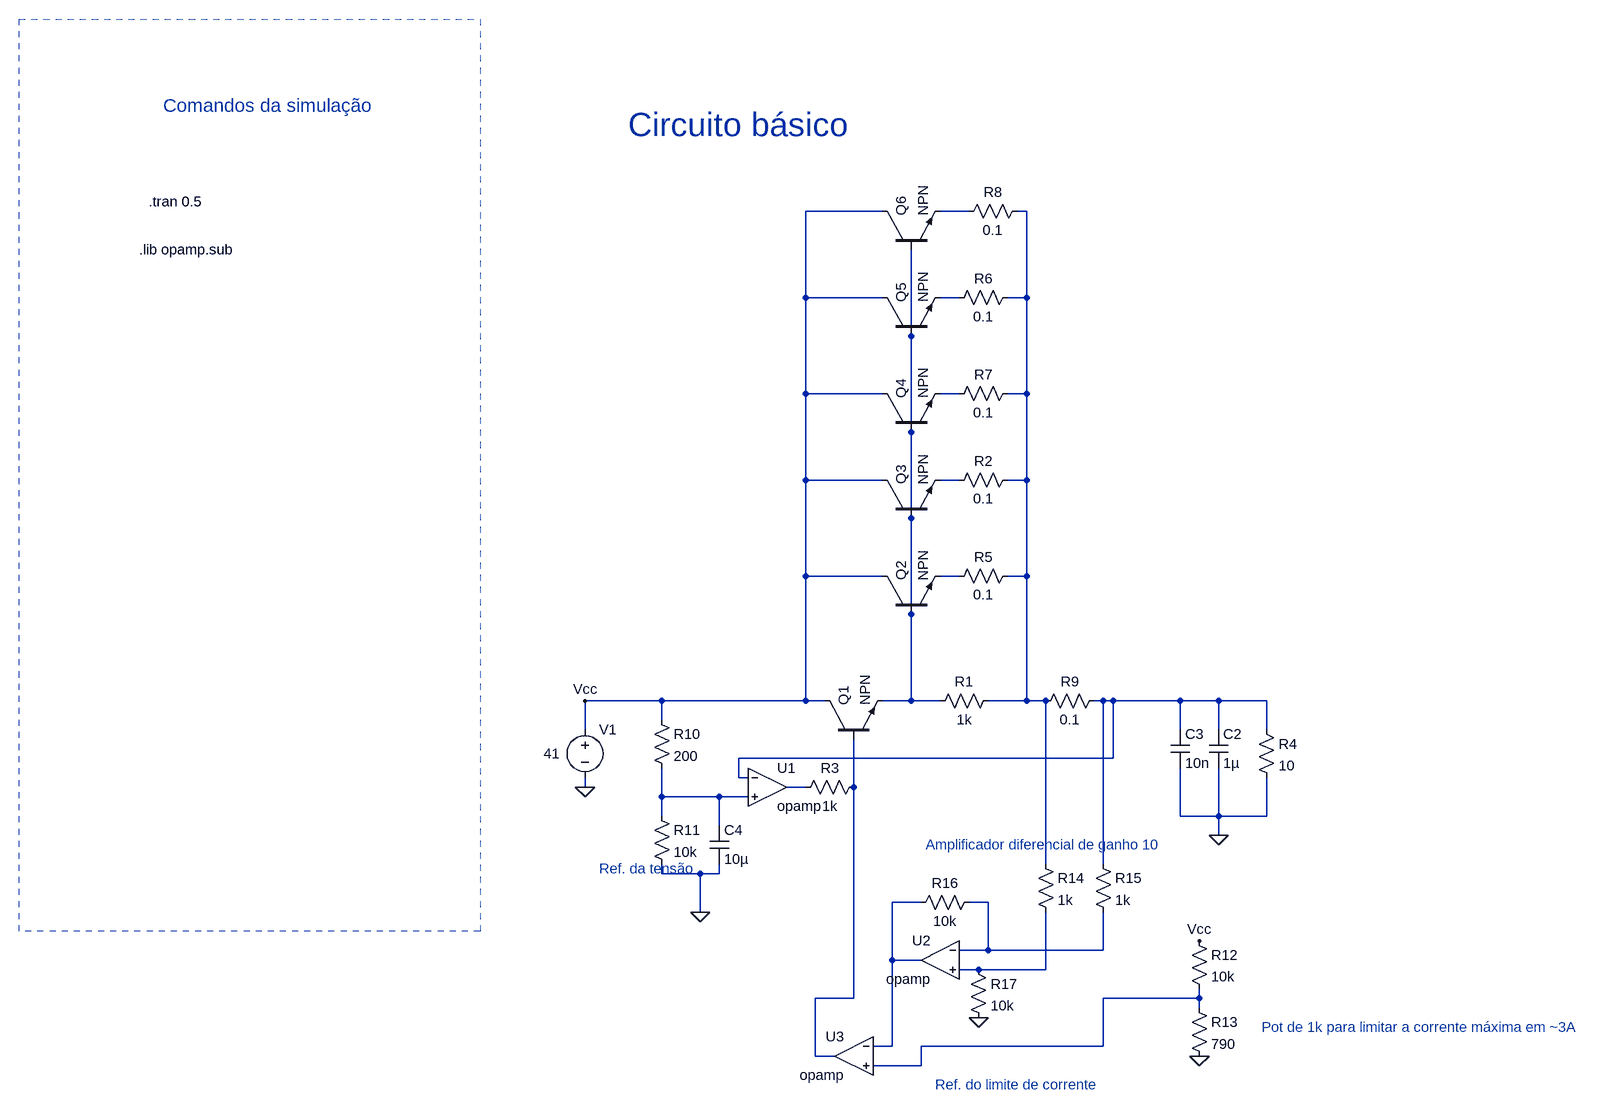
[diagram p0: schematic SimV2.asc]
SimV2.asc, the LTspice schematic file:
Version 4
SHEET 1 4884 2916
WIRE -64 240 -192 240
WIRE 80 240 32 240
WIRE 176 240 160 240
WIRE -192 384 -192 240
WIRE -64 384 -192 384
WIRE 64 384 32 384
WIRE 176 384 176 240
WIRE 176 384 144 384
WIRE -16 448 -16 304
WIRE -192 544 -192 384
WIRE -64 544 -192 544
WIRE 64 544 32 544
WIRE 176 544 176 384
WIRE 176 544 144 544
WIRE -16 608 -16 448
WIRE -192 688 -192 544
WIRE -64 688 -192 688
WIRE 64 688 32 688
WIRE 176 688 176 544
WIRE 176 688 144 688
WIRE -16 752 -16 608
WIRE -192 848 -192 688
WIRE -64 848 -192 848
WIRE 64 848 32 848
WIRE 176 848 176 688
WIRE 176 848 144 848
WIRE -16 912 -16 752
WIRE -432 1056 -560 1056
WIRE -192 1056 -192 848
WIRE -192 1056 -432 1056
WIRE -160 1056 -192 1056
WIRE -16 1056 -16 912
WIRE -16 1056 -64 1056
WIRE 32 1056 -16 1056
WIRE 176 1056 176 848
WIRE 176 1056 112 1056
WIRE 208 1056 176 1056
WIRE 304 1056 288 1056
WIRE 320 1056 304 1056
WIRE 432 1056 320 1056
WIRE 496 1056 432 1056
WIRE 576 1056 496 1056
WIRE -432 1088 -432 1056
WIRE -560 1104 -560 1056
WIRE 432 1104 432 1056
WIRE 496 1104 496 1056
WIRE 576 1104 576 1056
WIRE 320 1152 320 1056
WIRE 320 1152 -304 1152
WIRE -304 1184 -304 1152
WIRE -288 1184 -304 1184
WIRE -560 1200 -560 1184
WIRE -192 1200 -224 1200
WIRE -112 1200 -112 1120
WIRE -432 1216 -432 1168
WIRE -336 1216 -432 1216
WIRE -288 1216 -336 1216
WIRE -432 1248 -432 1216
WIRE 432 1248 432 1168
WIRE 496 1248 496 1168
WIRE 496 1248 432 1248
WIRE 576 1248 576 1184
WIRE 576 1248 496 1248
WIRE -336 1264 -336 1216
WIRE 496 1280 496 1248
WIRE 208 1328 208 1056
WIRE 304 1328 304 1056
WIRE -432 1344 -432 1328
WIRE -368 1344 -432 1344
WIRE -336 1344 -336 1328
WIRE -336 1344 -368 1344
WIRE 0 1392 -48 1392
WIRE 112 1392 80 1392
WIRE -368 1408 -368 1344
WIRE 112 1472 112 1392
WIRE 112 1472 64 1472
WIRE 304 1472 304 1408
WIRE 304 1472 112 1472
WIRE -48 1488 -48 1392
WIRE 0 1488 -48 1488
WIRE 96 1504 64 1504
WIRE 208 1504 208 1408
WIRE 208 1504 96 1504
WIRE -112 1552 -112 1200
WIRE -112 1552 -176 1552
WIRE 464 1552 464 1536
WIRE 464 1552 304 1552
WIRE 464 1568 464 1552
WIRE -48 1632 -48 1488
WIRE -48 1632 -80 1632
WIRE 304 1632 304 1552
WIRE 304 1632 0 1632
WIRE -176 1648 -176 1552
WIRE -144 1648 -176 1648
WIRE 0 1664 0 1632
WIRE 0 1664 -80 1664
FLAG -368 1408 0
FLAG -560 1200 0
FLAG -560 1056 Vcc
FLAG 496 1280 0
FLAG 464 1456 Vcc
FLAG 464 1648 0
FLAG 96 1584 0
DATAFLAG 400 992 "V(n002)-V(n008)"
SYMBOL OpAmps\\opamp -256 1136 R0
SYMATTR InstName U1
SYMBOL res 560 1088 R0
SYMATTR InstName R4
SYMATTR Value 10
SYMBOL npn -160 1120 R270
SYMATTR InstName Q1
SYMBOL npn -64 912 R270
SYMATTR InstName Q2
SYMBOL res 128 1040 R90
WINDOW 0 0 56 VBottom 2
WINDOW 3 32 56 VTop 2
SYMATTR InstName R1
SYMATTR Value 1k
SYMBOL voltage -560 1088 R0
WINDOW 3 -69 56 Left 2
WINDOW 123 0 0 Left 0
WINDOW 39 0 0 Left 0
SYMATTR Value 41
SYMATTR InstName V1
SYMBOL cap 480 1104 R0
SYMATTR InstName C2
SYMATTR Value 1µ
SYMBOL cap 416 1104 R0
SYMATTR InstName C3
SYMATTR Value 10n
SYMBOL res -96 1184 R90
WINDOW 0 0 56 VBottom 2
WINDOW 3 32 56 VTop 2
SYMATTR InstName R3
SYMATTR Value 1k
SYMBOL npn -64 752 R270
SYMATTR InstName Q3
SYMBOL res 160 672 R90
WINDOW 0 0 56 VBottom 2
WINDOW 3 32 56 VTop 2
SYMATTR InstName R2
SYMATTR Value 0.1
SYMBOL res 160 832 R90
WINDOW 0 0 56 VBottom 2
WINDOW 3 32 56 VTop 2
SYMATTR InstName R5
SYMATTR Value 0.1
SYMBOL npn -64 608 R270
SYMATTR InstName Q4
SYMBOL npn -64 448 R270
SYMATTR InstName Q5
SYMBOL res 160 368 R90
WINDOW 0 0 56 VBottom 2
WINDOW 3 32 56 VTop 2
SYMATTR InstName R6
SYMATTR Value 0.1
SYMBOL res 160 528 R90
WINDOW 0 0 56 VBottom 2
WINDOW 3 32 56 VTop 2
SYMATTR InstName R7
SYMATTR Value 0.1
SYMBOL npn -64 304 R270
SYMATTR InstName Q6
SYMBOL res 176 224 R90
WINDOW 0 0 56 VBottom 2
WINDOW 3 32 56 VTop 2
SYMATTR InstName R8
SYMATTR Value 0.1
SYMBOL res -448 1072 R0
SYMATTR InstName R10
SYMATTR Value 200
SYMBOL res -448 1232 R0
SYMATTR InstName R11
SYMATTR Value 10k
SYMBOL cap -352 1264 R0
SYMATTR InstName C4
SYMATTR Value 10µ
SYMBOL res 192 1072 R270
WINDOW 0 32 56 VTop 2
WINDOW 3 0 56 VBottom 2
SYMATTR InstName R9
SYMATTR Value 0.1
SYMBOL OpAmps\\opamp 32 1424 M0
SYMATTR InstName U2
SYMBOL res 448 1440 R0
SYMATTR InstName R12
SYMATTR Value 10k
SYMBOL res 448 1552 R0
SYMATTR InstName R13
SYMATTR Value 790
SYMBOL res 192 1312 R0
SYMATTR InstName R14
SYMATTR Value 1k
SYMBOL res 288 1312 R0
SYMATTR InstName R15
SYMATTR Value 1k
SYMBOL res 96 1376 R90
WINDOW 0 0 56 VBottom 2
WINDOW 3 32 56 VTop 2
SYMATTR InstName R16
SYMATTR Value 10k
SYMBOL res 80 1488 R0
SYMATTR InstName R17
SYMATTR Value 10k
SYMBOL OpAmps\\opamp -112 1584 M0
SYMATTR InstName U3
TEXT -2568 304 Left 2 !.lib opamp.sub
TEXT -2552 224 Left 2 !.tran 0.5
TEXT -488 96 Left 5 ;Circuito básico
TEXT -2528 64 Left 3 ;Comandos da simulação
TEXT 568 1600 Left 2 ;Pot de 1k para limitar a corrente máxima em ~3A
TEXT 8 1296 Left 2 ;Amplificador diferencial de ganho 10
TEXT 24 1696 Left 2 ;Ref. do limite de corrente
TEXT -536 1336 Left 2 ;Ref. da tensão
RECTANGLE Normal -2000 1440 -2768 -80 2

The netlist it stands for:
* SimV2.asc
XU1 N008 N011 N009 opamp Aol=100K GBW=10Meg  ; pins invin noninvin out
R4 N008 0 10
Q1 Vcc N010 N004 0 NPN
Q2 Vcc N004 N007 0 NPN
R1 N002 N004 1k
V1 Vcc 0 41
C2 N008 0 1µ
C3 N008 0 10n
R3 N010 N009 1k
Q3 Vcc N004 N006 0 NPN
R2 N002 N006 0.1
R5 N002 N007 0.1
Q4 Vcc N004 N005 0 NPN
Q5 Vcc N004 N003 0 NPN
R6 N002 N003 0.1
R7 N002 N005 0.1
Q6 Vcc N004 N001 0 NPN
R8 N002 N001 0.1
R10 Vcc N011 200
R11 N011 0 10k
C4 N011 0 10µ
R9 N002 N008 0.1
XU2 N013 N014 N012 opamp Aol=100K GBW=10Meg  ; pins invin noninvin out
R12 Vcc N015 10k
R13 N015 0 790
R14 N002 N014 1k
R15 N008 N013 1k
R16 N013 N012 10k
R17 N014 0 10k
XU3 N012 N015 N010 opamp Aol=100K GBW=10Meg  ; pins invin noninvin out
.model NPN NPN
.model PNP PNP
.lib standard.bjt
.lib opamp.sub
.tran 0.5
* Circuito básico
* Comandos da simulação
* Pot de 1k para limitar a corrente máxima em ~3A
* Amplificador diferencial de ganho 10
* Ref. do limite de corrente
* Ref. da tensão
.backanno
.end